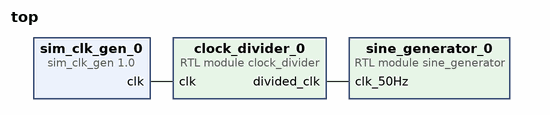
[diagram p0: block diagram of the top level]
# Vivado block design top, xc7z020clg484-1, Vivado 2019.2
create_bd_design top

create_bd_cell -type ip -vlnv xilinx.com:ip:sim_clk_gen:1.0 sim_clk_gen_0
create_bd_cell -type module -reference clock_divider clock_divider_0
set_property -dict {CONFIG.f 50} [get_bd_cells clock_divider_0]
create_bd_cell -type module -reference sine_generator sine_generator_0

# ---- connections ----

connect_bd_net [get_bd_pins clock_divider_0/divided_clk] [get_bd_pins sine_generator_0/clk_50Hz]
connect_bd_net [get_bd_pins sim_clk_gen_0/clk] [get_bd_pins clock_divider_0/clk]

validate_bd_design
save_bd_design
